# EAGLE schematic Control (EAGLE 7.2.0)
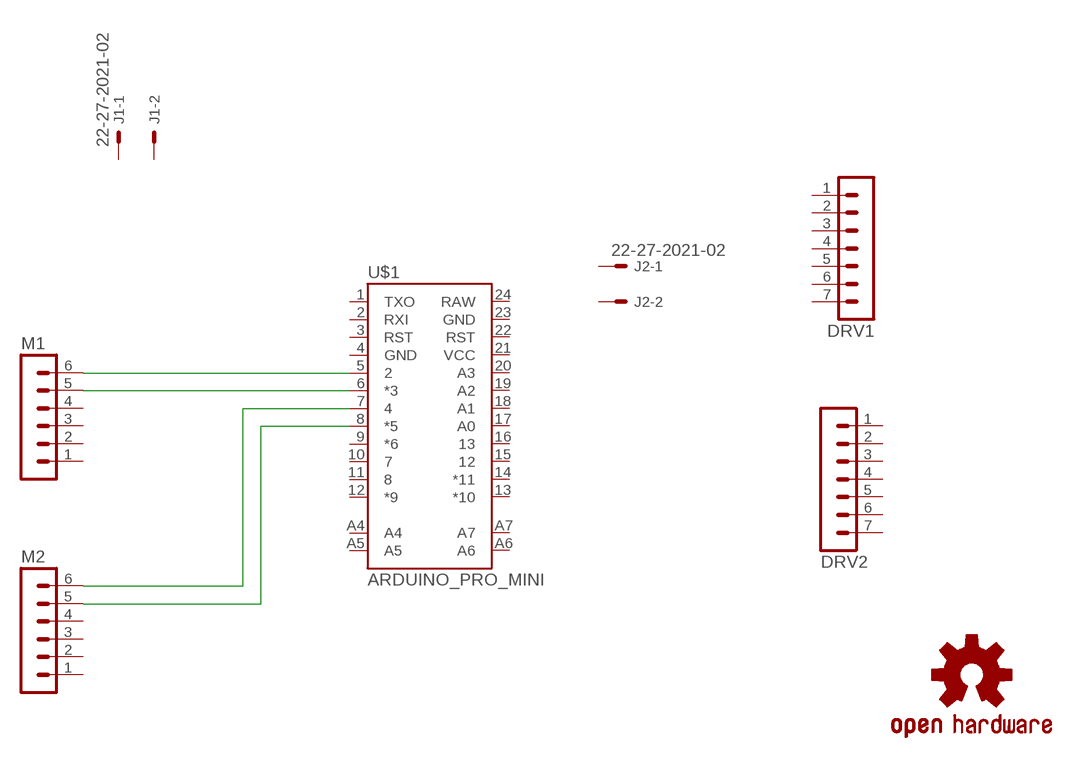
[diagram p0: schematic, sheet 1]

## Parts
DRV1  MA07-1  [MA07-1]
DRV2  MA07-1  [MA07-1]
J1  22-27-2021-02  [6410-02]
J2  22-27-2021-02  [6410-02]
LOGO1  OSHW-LOGOL-COPPER  [OSHW-LOGO-L_COPPER]
M1  MA06-1  [MA06-1]
M2  MA06-1  [MA06-1]
U$1  ARDUINO_PRO_MINI  [ARDUINO_PRO_MINI]

## Nets
N$1: M1.5 U$1.6(*3)
N$2: M1.6 U$1.5
N$3: M2.6 U$1.7
N$4: M2.5 U$1.8(*5)
Unconnected: DRV1.1 DRV1.2 DRV1.3 DRV1.4 DRV1.5 DRV1.6 DRV1.7 DRV2.1 DRV2.2 DRV2.3 DRV2.4 DRV2.5 DRV2.6 DRV2.7 J1.1 J1.2 J2.1 J2.2 M1.1 M1.2 M1.3 M1.4 M2.1 M2.2 M2.3 M2.4 U$1.1(TXO) U$1.2(RXI) U$1.3(RST) U$1.4(GND) U$1.9(*6) U$1.10 U$1.11 U$1.12(*9) U$1.13(*10) U$1.14(*11) U$1.15 U$1.16 U$1.17(A0) U$1.18(A1) U$1.19(A2) U$1.20(A3) U$1.21(VCC) U$1.22(RST) U$1.23(GND) U$1.24(RAW) U$1.A4 U$1.A5 U$1.A6 U$1.A7

## Library data of the parts
DRV1 DRV2 = con-lstb:MA07-1: PIN HEADER; OC_FARNELL: unknown; OC_NEWARK: unknown
J1 J2 = con-molex:22-?-02: CONNECTOR wire to board 2.54 mm (.1 inch) pitch header; OC_FARNELL: unknown; OC_NEWARK: unknown
LOGO1 = SparkFun-Aesthetics:OSHW-LOGO: Open Source Hardware Logo This logo indicates the piece of hardware it is found on incorporates a OSHW license and/or adheres to the definition of open source hardware found here: http://freedomdefined.org/OSHW
M1 M2 = con-lstb:MA06-1: PIN HEADER; OC_FARNELL: unknown; OC_NEWARK: unknown
U$1 = SparkFun-Boards:ARDUINO_PRO_MINI